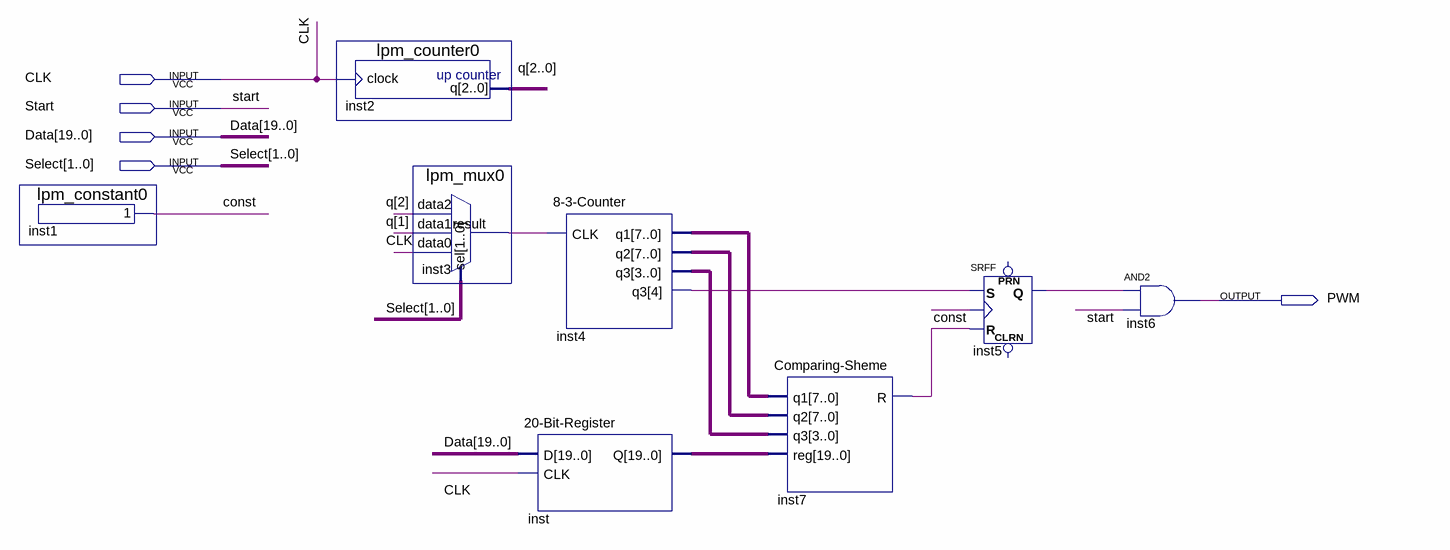
[diagram p0: schematic sheet]
// Quartus schematic kurs.bdf as structural Verilog: 8 symbols, 5 pins
module kurs (
  input  CLK,
  input  Start,
  input  [19:0] Data,
  input  [1:0] Select,
  output PWM
);

  wire \const , inst3_result, inst4_q3, inst5_q, inst7_r;
  wire [2:0] q;
  wire [3:0] inst4_q3_2;
  wire [7:0] inst4_q1, inst4_q2;
  wire [19:0] inst_q;

  lpm_constant0 inst1 (.result(\const ));
  lpm_counter0 inst2 (.clock(CLK), .q(q));
  lpm_mux0 inst3 (.data2(q[2]), .data1(q[1]), .data0(CLK), .sel(Select), .result(inst3_result));
  \8-3-Counter  inst4 (.CLK(inst3_result), .q1(inst4_q1), .q2(inst4_q2), .q3({inst4_q3, inst4_q3_2}));
  \20-Bit-Register  inst (.D(Data), .CLK(CLK), .Q(inst_q));
  \Comparing-Sheme  inst7 (.q1(inst4_q1), .q2(inst4_q2), .q3(inst4_q3_2), .\reg (inst_q), .R(inst7_r));
  SRFF inst5 (.S(inst4_q3), .R(inst7_r), .CLK(\const ), .Q(inst5_q));  // open: PRN, CLRN
  and inst6 (PWM, inst5_q, Start);
endmodule
